# Altium schematic sheet 08_USB_To_UART.SchDoc
size A; ApprovedDate: 04/02/2019; AssemblyNumber: ECE315-F19
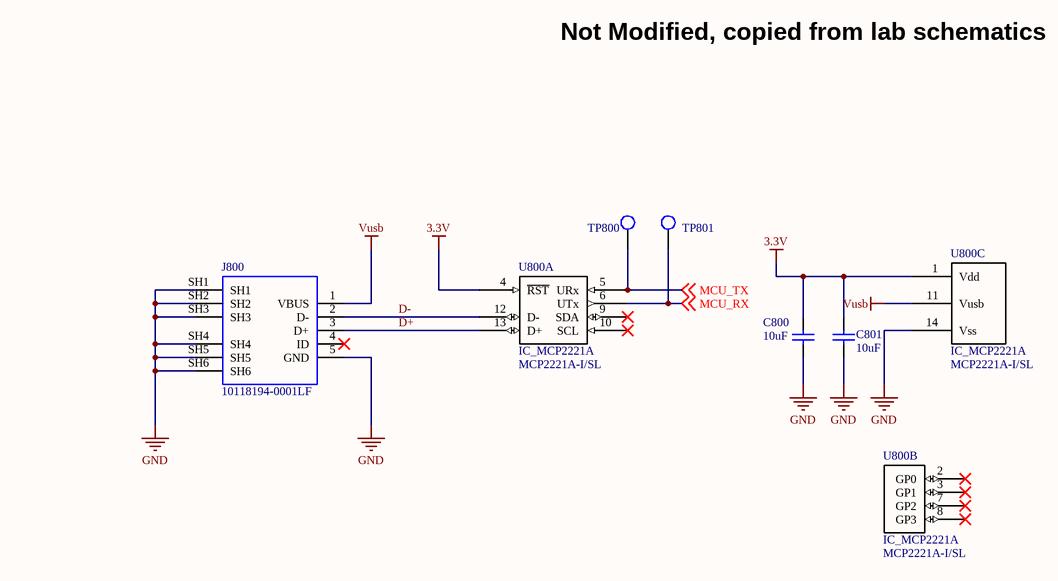
[diagram p0: 08_USB_To_UART.SchDoc]

## Parts
C800  10uF  [CAP_0805]
C801  10uF  [CAP_0805]
J800  Manufacturer Part Number: 10118194-0001LF  [USB_MICRO_B]  (hidden comment: USB_MICRO_B_10118194-0001LF)
TP800  TP_1206  [TP-SMC-1206]  (value not drawn)
TP801  TP_1206  [TP-SMC-1206]  (value not drawn)
U800  IC_MCP2221A  Manufacturer Part Number: MCP2221A-I/SL  [IC_MCP2221A]  (parts A,B,C of 3)

## Nets
3.3V: C800.2 C801.2 U800.1(Vdd) U800.4(~{RST})
GND: C800.1 C801.1 J800.5(GND) J800.SH1 J800.SH2 J800.SH3 J800.SH4 J800.SH5 J800.SH6 U800.14(Vss)
Vusb: J800.1(VBUS) U800.11(Vusb)
D+: J800.3(D+) U800.13(D+)
D-: J800.2(D-) U800.12(D-)
MCU_RX: TP801.1 U800.6(UTx) ; off-sheet MCU_RX
MCU_TX: TP800.1 U800.5(URx) ; off-sheet MCU_TX

Not connected (* = marked no-connect by the designer): J800 4(ID)*; U800 2(GP0)* 3(GP1)* 7(GP2)* 8(GP3)* 9(SDA)* 10(SCL)*

## Notes on the sheet
- Not Modified, copied from lab schematics

## Library data of the parts
C800 C801 = CAP_0805_U_010.00: CAP CER 10UF 16V X7R 0805; Manufacturer: Samsung; Manufacturer Part Number: CL21A106KPCLQNC; Tolerance: 10%; Voltage Rating: 10V; Dielectric: X5R; ComponentLink3URL: https://datasheet.ciiva.com/26920/getdatasheetpartid-355170-26920201.pdf; ComponentLink3Description: https://datasheet.ciiva.com/26920/getdatasheetpartid-355170-26920201.pdf; Supplier 1: Digi-Key; Stock 1: 40000; Pricing 1: 1=0.22, 10=0.148, 100=0.0749, 500=0.05122, 1000=0.04531 (USD); Mount: Surface Mount; Case/Package: 0805; Case Code (Metric): 2012; Case Code (Imperial): 0805; Contact Plating: Tin; Min Operating Temperature: -55°C; Max Operating Temperature: 85°C; Packaging: Tape and Reel; Package Quantity: 1; Length: 2mm; Height: 0.85mm; Width: 0.049inch; Thickness: 0.037inch; Depth: 1.25mm; Radiation Hardening: No; ComponentLink1URL: https://datasheet.ciiva.com/25730/cl21a106kpclqnc-25730594.pdf; ComponentLink1Description: https://datasheet.ciiva.com/25730/cl21a106kpclqnc-25730594.pdf; Supplier Part Number 1: 1276-2402-1-ND; Capacitance: 10uF
J800 = USB_MICRO_B_10118194-0001LF: CONN USB MICRO B RECPT SMT R/A; Manufacturer: Amphenol FCI; Pitch: 0.65mm; Connector Type: USB,Receptacle; Insulation Resistance: 1GR; Number of Contacts: 5; Number of Ports: 1; Current Rating: 1.8A; Gender: Receptacle; Max Voltage Rating (AC): 100V; Orientation: Right Angle; Depth: 5mm; Length: 8.05mm; Package Quantity: 9600; Supplier: Digi-Key; Max Operating Temperature: 85°C; Flammability Rating: UL94 V-0; Packaging: Tape and Reel; Color: Black; Mount: Surface Mount,Horizontal; Lead Free: Lead Free; Number of Terminals: 5; Housing Material: Polymer; Features: Shielded; Termination: Solder; Min Operating Temperature: -55°C; Contact Plating: Gold; Contact Material: Copper Alloy; Radiation Hardening: No; Supplier Part Number: 609-4618-1-ND
TP800 TP801 = TP_1206: Test Point SMD 1206; Manufacturer: TE Connectivity (Tyco Electronics); Manufacturer Part Number: 1625854-1; Resistance Value: 0 Ohm; Temperature Coefficient: N/R; Supplier 1: Digi-Key; Stock 1: 31937; Pricing 1: 1=0.28, 10=0.261, 25=0.224, 50=0.1902, 100=0.1828, 250=0.1641, 500=0.1567, 1000=0.1306 (USD); Case Size: 1206; Dimension: 3.2 x 1.6 x 1.25mm; Family: RC; Mounting: Surface Mount; Operating Temperature: -55 to 125 C; Part No: 1625854-1; RoHS: Yes; Packaging: Tape and Reel; Termination Style: N/R; Terminal Pitch: N/R; Power Rating: N/R; Tolerance: N/R; ComponentLink1URL: https://datasheet.ciiva.com/6439/eng-ds-1773266-a-6439169.pdf; ComponentLink1Description: https://datasheet.ciiva.com/6439/eng-ds-1773266-a-6439169.pdf; ComponentLink2URL: https://datasheet.ciiva.com/30136/1773266-a-30136341.pdf; ComponentLink2Description: https://datasheet.ciiva.com/30136/1773266-a-30136341.pdf; ComponentLink3URL: https://datasheet.ciiva.com/6439/eng-ds-1773266-a-6439080.pdf; ComponentLink3Description: https://datasheet.ciiva.com/6439/eng-ds-1773266-a-6439080.pdf; ComponentLink4URL: https://datasheet.ciiva.com/6439/eng-ds-1773266-a-6439081.pdf; ComponentLink4Description: https://datasheet.ciiva.com/6439/eng-ds-1773266-a-6439081.pdf; ComponentLink5URL: https://datasheet.ciiva.com/6439/eng-ds-1773266-a-6439083.pdf; ComponentLink5Description: https://datasheet.ciiva.com/6439/eng-ds-1773266-a-6439083.pdf; Supplier Part Number 1: A106143CT-ND
U800 = IC_MCP2221A: IC USB TO I2C/UART 14SOIC; Manufacturer: Microchip; Interface: I2C,UART; Operating Supply Current: 13mA; Supplier 1: Digi-Key; Stock 1: 1104; Pricing 1: 1=1.95, 25=1.6276, 100=1.4832 (USD); Case/Package: SOIC; Min Operating Temperature: -40°C; Max Operating Temperature: 85°C; Packaging: Rail/Tube; Supplier Part Number 1: MCP2221A-I/SL-ND